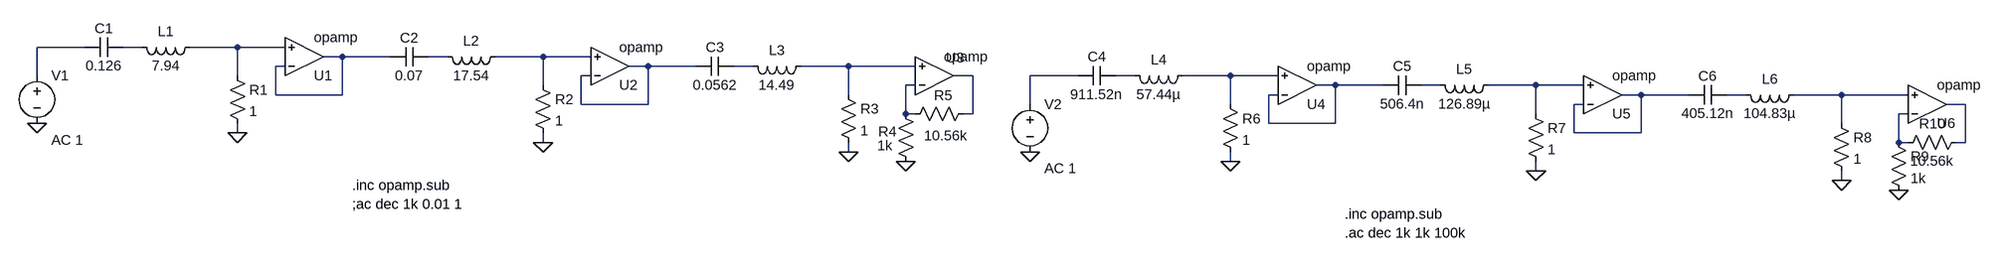
[diagram p0: schematic TS4.asc]
TS4.asc, the LTspice schematic file:
Version 4
SHEET 1 3108 680
WIRE -48 64 -128 64
WIRE 48 64 16 64
WIRE 208 64 128 64
WIRE 288 64 208 64
WIRE 384 80 352 80
WIRE 464 80 384 80
WIRE 560 80 528 80
WIRE 720 80 640 80
WIRE 800 80 720 80
WIRE 288 96 272 96
WIRE 896 96 864 96
WIRE 976 96 896 96
WIRE 1072 96 1040 96
WIRE 1232 96 1152 96
WIRE 1344 96 1232 96
WIRE -128 112 -128 64
WIRE 208 112 208 64
WIRE 800 112 784 112
WIRE 1440 112 1408 112
WIRE 1616 112 1536 112
WIRE 1712 112 1680 112
WIRE 1872 112 1792 112
WIRE 1952 112 1872 112
WIRE 720 128 720 80
WIRE 1344 128 1328 128
WIRE 2048 128 2016 128
WIRE 2128 128 2048 128
WIRE 2224 128 2192 128
WIRE 2384 128 2304 128
WIRE 2464 128 2384 128
WIRE 272 144 272 96
WIRE 384 144 384 80
WIRE 384 144 272 144
WIRE 1232 144 1232 96
WIRE 1952 144 1936 144
WIRE 2560 144 2528 144
WIRE 2640 144 2560 144
WIRE 2736 144 2704 144
WIRE 2896 144 2816 144
WIRE 3008 144 2896 144
WIRE 784 160 784 112
WIRE 896 160 896 96
WIRE 896 160 784 160
WIRE 1536 160 1536 112
WIRE 1872 160 1872 112
WIRE 2464 160 2448 160
WIRE 3104 160 3072 160
WIRE 1328 176 1328 128
WIRE 1344 176 1328 176
WIRE 1440 176 1440 112
WIRE 1440 176 1424 176
WIRE 2384 176 2384 128
WIRE 3008 176 2992 176
WIRE 1936 192 1936 144
WIRE 2048 192 2048 128
WIRE 2048 192 1936 192
WIRE 2896 192 2896 144
WIRE 208 208 208 192
WIRE 2448 208 2448 160
WIRE 2560 208 2560 144
WIRE 2560 208 2448 208
WIRE 720 224 720 208
WIRE 2992 224 2992 176
WIRE 3008 224 2992 224
WIRE 3104 224 3104 160
WIRE 3104 224 3088 224
WIRE 1232 240 1232 224
WIRE 1872 256 1872 240
WIRE 2384 272 2384 256
WIRE 2896 288 2896 272
FLAG 208 208 0
FLAG 720 224 0
FLAG 1232 240 0
FLAG -128 192 0
FLAG 1328 256 0
FLAG 1872 256 0
FLAG 2384 272 0
FLAG 2896 288 0
FLAG 1536 240 0
FLAG 2992 304 0
SYMBOL cap 16 48 R90
WINDOW 0 0 32 VBottom 2
WINDOW 3 32 32 VTop 2
SYMATTR InstName C1
SYMATTR Value 0.126
SYMBOL ind 144 48 R90
WINDOW 0 5 56 VBottom 2
WINDOW 3 32 56 VTop 2
SYMATTR InstName L1
SYMATTR Value 7.94
SYMBOL res 192 96 R0
SYMATTR InstName R1
SYMATTR Value 1
SYMBOL OpAmps\\opamp 320 144 M180
SYMATTR InstName U1
SYMBOL cap 528 64 R90
WINDOW 0 0 32 VBottom 2
WINDOW 3 32 32 VTop 2
SYMATTR InstName C2
SYMATTR Value 0.07
SYMBOL ind 656 64 R90
WINDOW 0 5 56 VBottom 2
WINDOW 3 32 56 VTop 2
SYMATTR InstName L2
SYMATTR Value 17.54
SYMBOL res 704 112 R0
SYMATTR InstName R2
SYMATTR Value 1
SYMBOL OpAmps\\opamp 832 160 M180
SYMATTR InstName U2
SYMBOL cap 1040 80 R90
WINDOW 0 0 32 VBottom 2
WINDOW 3 32 32 VTop 2
SYMATTR InstName C3
SYMATTR Value 0.0562
SYMBOL ind 1168 80 R90
WINDOW 0 5 56 VBottom 2
WINDOW 3 32 56 VTop 2
SYMATTR InstName L3
SYMATTR Value 14.49
SYMBOL res 1216 128 R0
SYMATTR InstName R3
SYMATTR Value 1
SYMBOL voltage -128 96 R0
WINDOW 123 24 124 Left 2
WINDOW 39 0 0 Left 0
SYMATTR InstName V1
SYMATTR Value ""
SYMATTR Value2 AC 1
SYMBOL OpAmps\\opamp 1376 176 M180
WINDOW 0 19 94 Left 2
SYMATTR InstName U3
SYMBOL res 1312 160 R0
WINDOW 0 -30 46 Left 2
WINDOW 3 -32 69 Left 2
SYMATTR InstName R4
SYMATTR Value 1k
SYMBOL res 1440 160 R90
WINDOW 0 1 49 VBottom 2
WINDOW 3 37 45 VTop 2
SYMATTR InstName R5
SYMATTR Value 10.56k
SYMBOL cap 1680 96 R90
WINDOW 0 0 32 VBottom 2
WINDOW 3 32 32 VTop 2
SYMATTR InstName C4
SYMATTR Value 911.52n
SYMBOL ind 1808 96 R90
WINDOW 0 5 56 VBottom 2
WINDOW 3 32 56 VTop 2
SYMATTR InstName L4
SYMATTR Value 57.44µ
SYMBOL res 1856 144 R0
SYMATTR InstName R6
SYMATTR Value 1
SYMBOL OpAmps\\opamp 1984 192 M180
SYMATTR InstName U4
SYMBOL cap 2192 112 R90
WINDOW 0 0 32 VBottom 2
WINDOW 3 32 32 VTop 2
SYMATTR InstName C5
SYMATTR Value 506.4n
SYMBOL ind 2320 112 R90
WINDOW 0 5 56 VBottom 2
WINDOW 3 32 56 VTop 2
SYMATTR InstName L5
SYMATTR Value 126.89µ
SYMBOL res 2368 160 R0
SYMATTR InstName R7
SYMATTR Value 1
SYMBOL OpAmps\\opamp 2496 208 M180
SYMATTR InstName U5
SYMBOL cap 2704 128 R90
WINDOW 0 0 32 VBottom 2
WINDOW 3 32 32 VTop 2
SYMATTR InstName C6
SYMATTR Value 405.12n
SYMBOL ind 2832 128 R90
WINDOW 0 5 56 VBottom 2
WINDOW 3 32 56 VTop 2
SYMATTR InstName L6
SYMATTR Value 104.83µ
SYMBOL res 2880 176 R0
SYMATTR InstName R8
SYMATTR Value 1
SYMBOL voltage 1536 144 R0
WINDOW 123 24 124 Left 2
WINDOW 39 0 0 Left 0
SYMATTR InstName V2
SYMATTR Value ""
SYMATTR Value2 AC 1
SYMBOL OpAmps\\opamp 3040 224 M180
SYMATTR InstName U6
SYMBOL res 2976 208 R0
SYMATTR InstName R9
SYMATTR Value 1k
SYMBOL res 3104 208 R90
WINDOW 0 0 56 VBottom 2
WINDOW 3 32 56 VTop 2
SYMATTR InstName R10
SYMATTR Value 10.56k
TEXT 400 296 Left 2 !.inc opamp.sub
TEXT 400 328 Left 2 !;ac dec 1k 0.01 1
TEXT 2064 344 Left 2 !.inc opamp.sub
TEXT 2064 376 Left 2 !.ac dec 1k 1k 100k

The netlist it stands for:
* TS4.asc
C1 N002 N001 0.126
L1 N003 N002 7.94
R1 N003 0 1
XU1 N004 N003 N004 opamp Aol=100K GBW=10Meg  ; pins invin noninvin out
C2 N005 N004 0.07
L2 N006 N005 17.54
R2 N006 0 1
XU2 N007 N006 N007 opamp Aol=100K GBW=10Meg  ; pins invin noninvin out
C3 N008 N007 0.0562
L3 N009 N008 14.49
R3 N009 0 1
V1 N001 0 AC 1
XU3 N014 N009 N010 opamp Aol=100K GBW=10Meg  ; pins invin noninvin out
R4 N014 0 1k
R5 N010 N014 10.56k
C4 N012 N011 911.52n
L4 N013 N012 57.44µ
R6 N013 0 1
XU4 N015 N013 N015 opamp Aol=100K GBW=10Meg  ; pins invin noninvin out
C5 N016 N015 506.4n
L5 N017 N016 126.89µ
R7 N017 0 1
XU5 N018 N017 N018 opamp Aol=100K GBW=10Meg  ; pins invin noninvin out
C6 N019 N018 405.12n
L6 N020 N019 104.83µ
R8 N020 0 1
V2 N011 0 AC 1
XU6 N022 N020 N021 opamp Aol=100K GBW=10Meg  ; pins invin noninvin out
R9 N022 0 1k
R10 N021 N022 10.56k
.inc opamp.sub
;ac dec 1k 0.01 1
.inc opamp.sub
.ac dec 1k 1k 100k
.backanno
.end